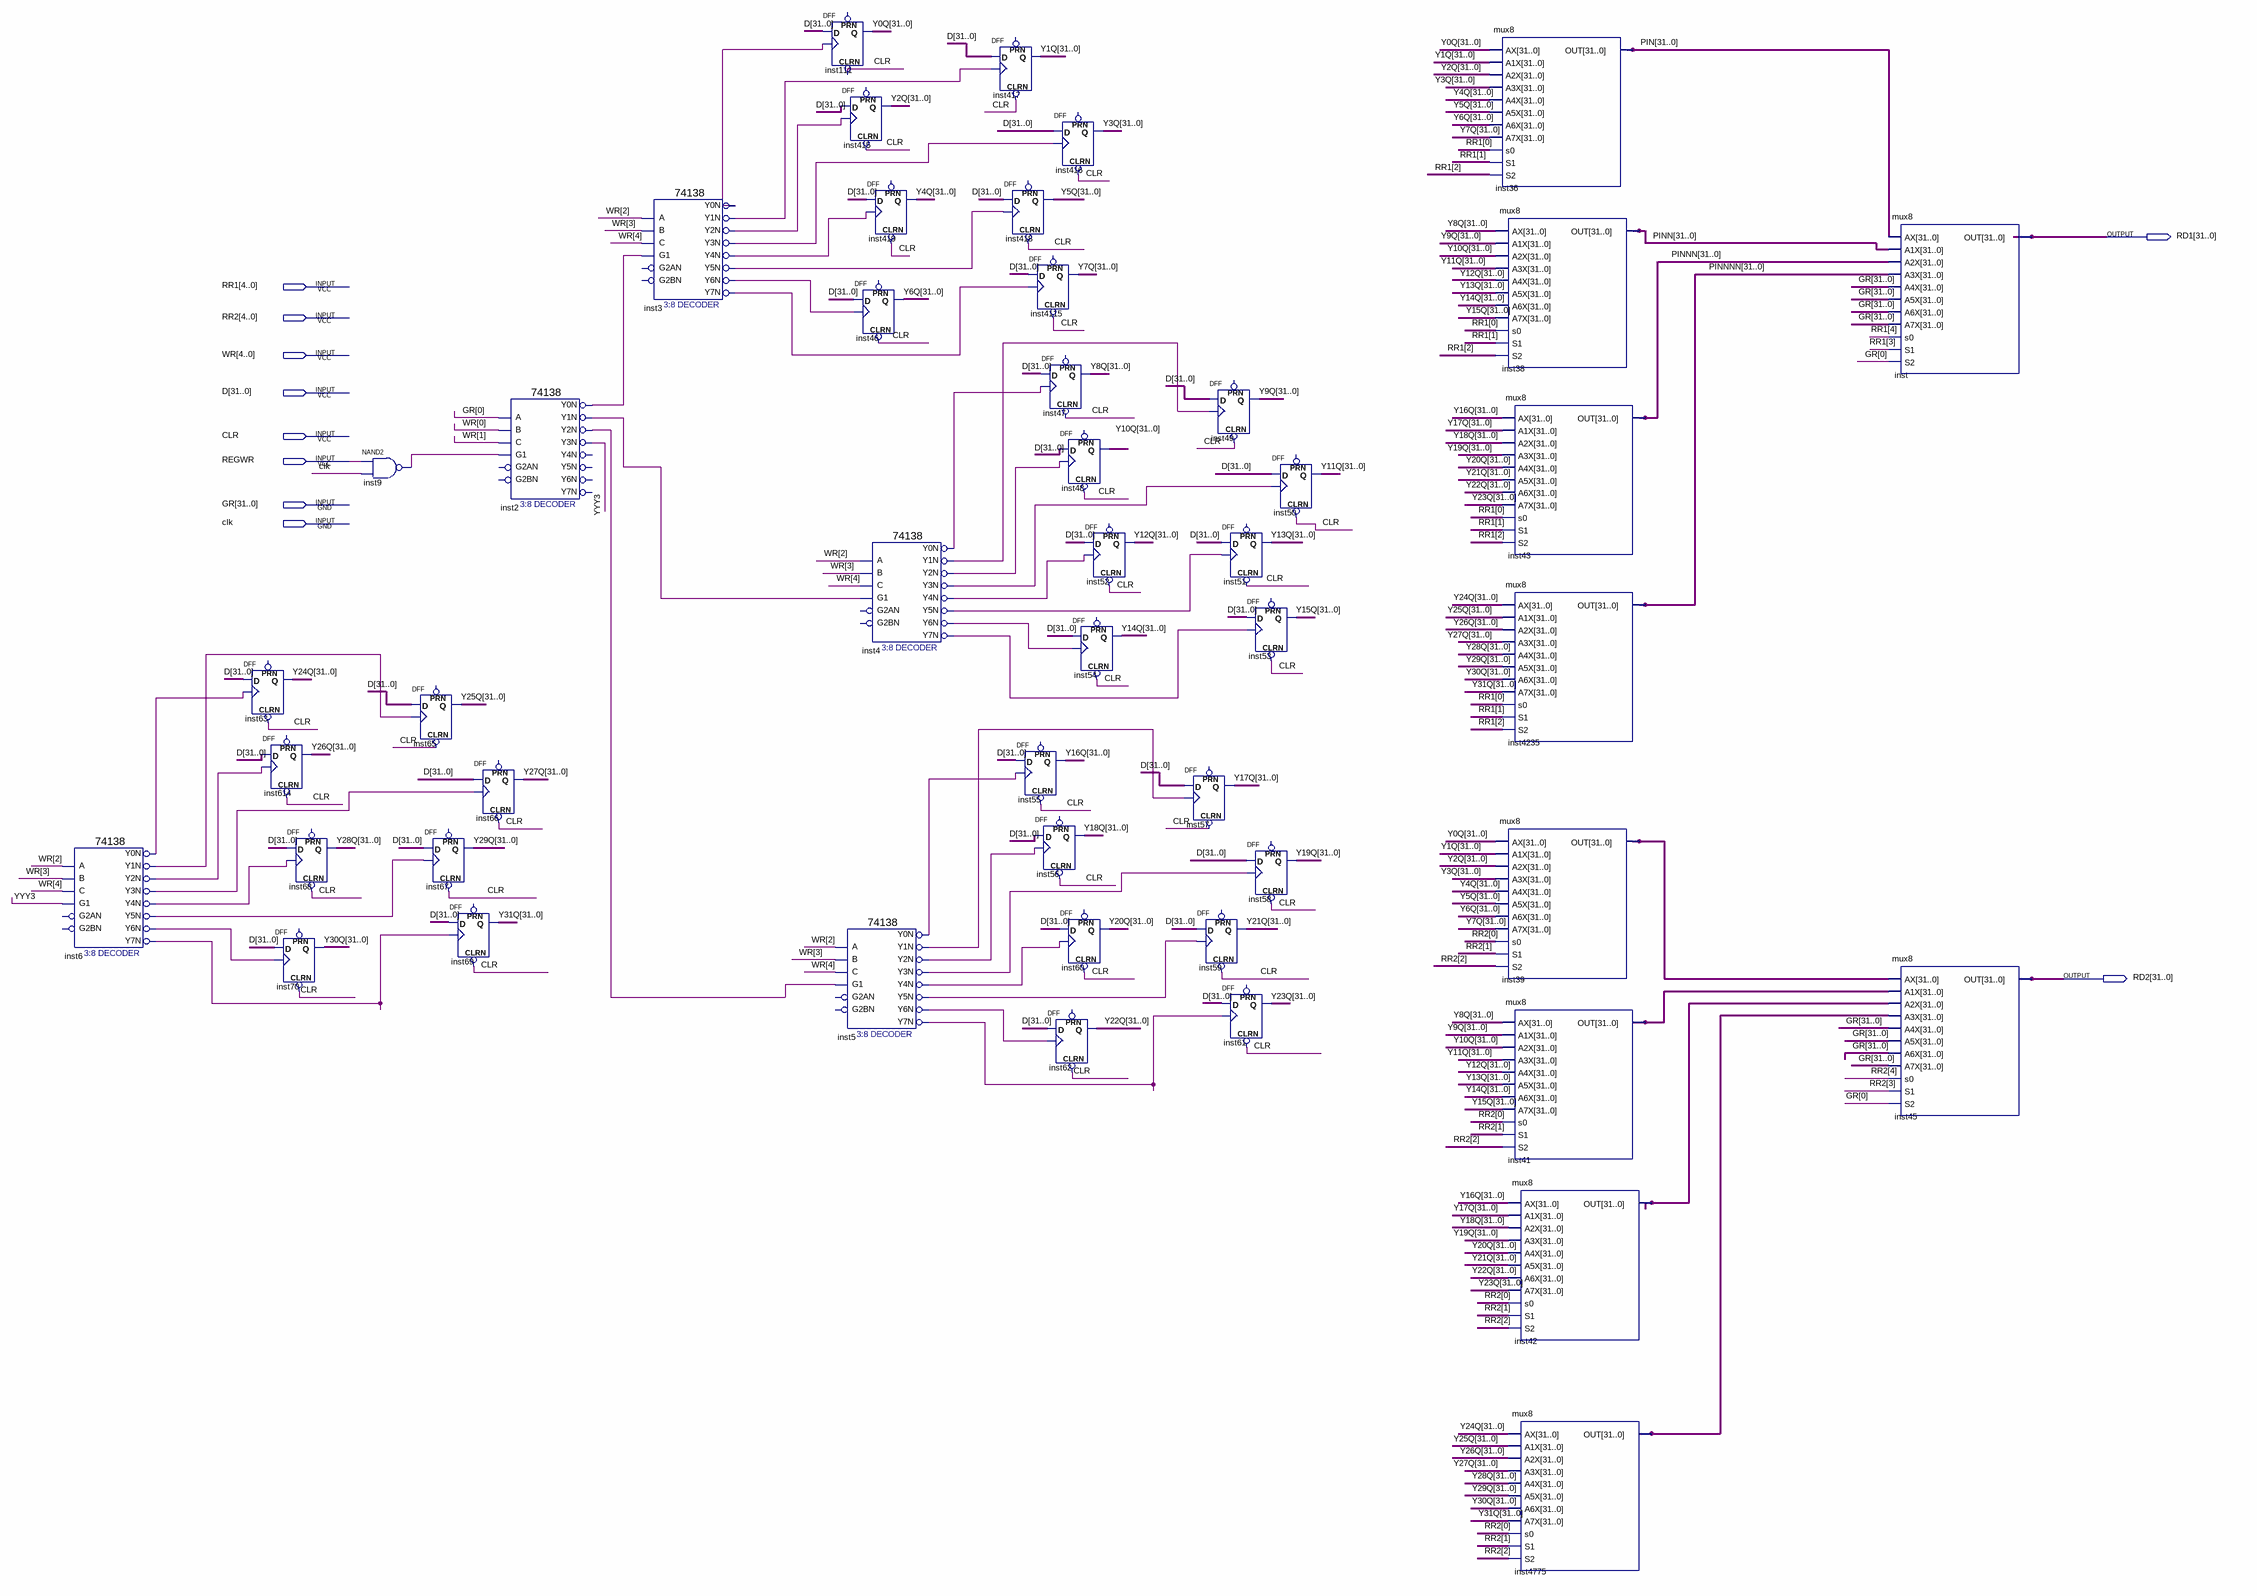
[diagram p0: schematic sheet]
// Quartus schematic caprj4.bdf as structural Verilog: 48 symbols, 10 pins
module caprj4 (
  input  [4:0] RR1,
  input  [4:0] RR2,
  input  [4:0] WR,
  input  [31:0] D,
  input  CLR,
  input  REGWR,
  input  [31:0] GR,
  input  clk,
  output [31:0] RD1,
  output [31:0] RD2
);

  wire inst2_y0n, inst2_y1n, inst2_y2n, inst3_y0n, inst3_y1n, inst3_y2n, inst3_y3n, inst3_y4n, inst3_y5n,
       inst3_y6n, inst3_y7n, inst4_y0n, inst4_y1n, inst4_y2n, inst4_y3n, inst4_y4n, inst4_y5n, inst4_y6n,
       inst4_y7n, inst5_y0n, inst5_y1n, inst5_y2n, inst5_y3n, inst5_y4n, inst5_y5n, inst5_y6n, inst5_y7n,
       inst6_y0n, inst6_y1n, inst6_y2n, inst6_y3n, inst6_y4n, inst6_y5n, inst6_y6n, inst6_y7n, inst9_out,
       YYY3;
  wire [31:0] inst39_out, inst41_out, inst42_out, inst4775_out, PIN, PINN, PINNN, PINNNN, Y0Q, Y1Q, Y2Q, Y3Q,
       Y4Q, Y5Q, Y6Q, Y7Q, Y8Q, Y9Q, Y10Q, Y11Q, Y12Q, Y13Q, Y14Q, Y15Q, Y16Q, Y17Q, Y18Q, Y19Q, Y20Q, Y21Q,
       Y22Q, Y23Q, Y24Q, Y25Q, Y26Q, Y27Q, Y28Q, Y29Q, Y30Q, Y31Q;

  \74138  inst6 (
    .A(WR[2]), .B(WR[3]), .G1(YYY3), .C(WR[4]), .Y0N(inst6_y0n), .Y1N(inst6_y1n), .Y2N(inst6_y2n),
    .Y3N(inst6_y3n), .Y4N(inst6_y4n), .Y5N(inst6_y5n), .Y6N(inst6_y6n), .Y7N(inst6_y7n));  // open: G2AN, G2BN
  DFF inst63[31:0] (.CLRN(CLR), .CLK(inst6_y0n), .D(D), .Q(Y24Q));  // open: PRN
  DFF inst614[31:0] (.CLRN(CLR), .CLK(inst6_y2n), .D(D), .Q(Y26Q));  // open: PRN
  DFF inst70[31:0] (.CLRN(CLR), .CLK(inst6_y6n), .D(D), .Q(Y30Q));  // open: PRN
  DFF inst68[31:0] (.CLRN(CLR), .CLK(inst6_y4n), .D(D), .Q(Y28Q));  // open: PRN
  nand inst9 (inst9_out, REGWR, clk);
  DFF inst65[31:0] (.CLRN(CLR), .CLK(inst6_y1n), .D(D), .Q(Y25Q));  // open: PRN
  DFF inst67[31:0] (.CLRN(CLR), .CLK(inst6_y5n), .D(D), .Q(Y29Q));  // open: PRN
  DFF inst66[31:0] (.CLRN(CLR), .CLK(inst6_y3n), .D(D), .Q(Y27Q));  // open: PRN
  DFF inst69[31:0] (.CLRN(CLR), .CLK(inst6_y7n), .D(D), .Q(Y31Q));  // open: PRN
  \74138  inst2 (
    .A(GR[0]), .B(WR[0]), .G1(inst9_out), .C(WR[1]), .Y0N(inst2_y0n), .Y1N(inst2_y1n), .Y2N(inst2_y2n),
    .Y3N(YYY3));  // open: G2AN, G2BN, Y4N, Y5N, Y6N, Y7N
  \74138  inst3 (
    .A(WR[2]), .B(WR[3]), .G1(inst2_y0n), .C(WR[4]), .Y0N(inst3_y0n), .Y1N(inst3_y1n), .Y2N(inst3_y2n),
    .Y3N(inst3_y3n), .Y4N(inst3_y4n), .Y5N(inst3_y5n), .Y6N(inst3_y6n), .Y7N(inst3_y7n));  // open: G2AN, G2BN
  DFF inst111[31:0] (.CLRN(CLR), .CLK(inst3_y0n), .D(D), .Q(Y0Q));  // open: PRN
  DFF inst415[31:0] (.CLRN(CLR), .CLK(inst3_y2n), .D(D), .Q(Y2Q));  // open: PRN
  DFF inst419[31:0] (.CLRN(CLR), .CLK(inst3_y4n), .D(D), .Q(Y4Q));  // open: PRN
  DFF inst46[31:0] (.CLRN(CLR), .CLK(inst3_y6n), .D(D), .Q(Y6Q));  // open: PRN
  \74138  inst4 (
    .A(WR[2]), .B(WR[3]), .G1(inst2_y1n), .C(WR[4]), .Y0N(inst4_y0n), .Y1N(inst4_y1n), .Y2N(inst4_y2n),
    .Y3N(inst4_y3n), .Y4N(inst4_y4n), .Y5N(inst4_y5n), .Y6N(inst4_y6n), .Y7N(inst4_y7n));  // open: G2AN, G2BN
  \74138  inst5 (
    .A(WR[2]), .B(WR[3]), .G1(inst2_y2n), .C(WR[4]), .Y0N(inst5_y0n), .Y1N(inst5_y1n), .Y2N(inst5_y2n),
    .Y3N(inst5_y3n), .Y4N(inst5_y4n), .Y5N(inst5_y5n), .Y6N(inst5_y6n), .Y7N(inst5_y7n));  // open: G2AN, G2BN
  DFF inst417[31:0] (.CLRN(CLR), .CLK(inst3_y1n), .D(D), .Q(Y1Q));  // open: PRN
  DFF inst418[31:0] (.CLRN(CLR), .CLK(inst3_y5n), .D(D), .Q(Y5Q));  // open: PRN
  DFF inst55[31:0] (.CLRN(CLR), .CLK(inst5_y0n), .D(D), .Q(Y16Q));  // open: PRN
  DFF inst416[31:0] (.CLRN(CLR), .CLK(inst3_y3n), .D(D), .Q(Y3Q));  // open: PRN
  DFF inst4115[31:0] (.CLRN(CLR), .CLK(inst3_y7n), .D(D), .Q(Y7Q));  // open: PRN
  DFF inst47[31:0] (.CLRN(CLR), .CLK(inst4_y0n), .D(D), .Q(Y8Q));  // open: PRN
  DFF inst48[31:0] (.CLRN(CLR), .CLK(inst4_y2n), .D(D), .Q(Y10Q));  // open: PRN
  DFF inst54[31:0] (.CLRN(CLR), .CLK(inst4_y6n), .D(D), .Q(Y14Q));  // open: PRN
  DFF inst56[31:0] (.CLRN(CLR), .CLK(inst5_y2n), .D(D), .Q(Y18Q));  // open: PRN
  DFF inst60[31:0] (.CLRN(CLR), .CLK(inst5_y4n), .D(D), .Q(Y20Q));  // open: PRN
  DFF inst62[31:0] (.CLRN(CLR), .CLK(inst5_y6n), .D(D), .Q(Y22Q));  // open: PRN
  DFF inst52[31:0] (.CLRN(CLR), .CLK(inst4_y4n), .D(D), .Q(Y12Q));  // open: PRN
  DFF inst49[31:0] (.CLRN(CLR), .CLK(inst4_y1n), .D(D), .Q(Y9Q));  // open: PRN
  DFF inst51[31:0] (.CLRN(CLR), .CLK(inst4_y5n), .D(D), .Q(Y13Q));  // open: PRN
  DFF inst57[31:0] (.CLRN(CLR), .CLK(inst5_y1n), .D(D), .Q(Y17Q));  // open: PRN
  DFF inst59[31:0] (.CLRN(CLR), .CLK(inst5_y5n), .D(D), .Q(Y21Q));  // open: PRN
  DFF inst61[31:0] (.CLRN(CLR), .CLK(inst5_y7n), .D(D), .Q(Y23Q));  // open: PRN
  DFF inst50[31:0] (.CLRN(CLR), .CLK(inst4_y3n), .D(D), .Q(Y11Q));  // open: PRN
  DFF inst53[31:0] (.CLRN(CLR), .CLK(inst4_y7n), .D(D), .Q(Y15Q));  // open: PRN
  DFF inst58[31:0] (.CLRN(CLR), .CLK(inst5_y3n), .D(D), .Q(Y19Q));  // open: PRN
  mux8 inst36 (
    .AX(Y0Q), .A1X(Y1Q), .A2X(Y2Q), .A3X(Y3Q), .A4X(Y4Q), .A5X(Y5Q), .A6X(Y6Q), .A7X(Y7Q), .s0(RR1[0]),
    .S1(RR1[1]), .S2(RR1[2]), .OUT(PIN));
  mux8 inst38 (
    .AX(Y8Q), .A1X(Y9Q), .A2X(Y10Q), .A3X(Y11Q), .A4X(Y12Q), .A5X(Y13Q), .A6X(Y14Q), .A7X(Y15Q), .s0(RR1[0]),
    .S1(RR1[1]), .S2(RR1[2]), .OUT(PINN));
  mux8 inst43 (
    .AX(Y16Q), .A1X(Y17Q), .A2X(Y18Q), .A3X(Y19Q), .A4X(Y20Q), .A5X(Y21Q), .A6X(Y22Q), .A7X(Y23Q),
    .s0(RR1[0]), .S1(RR1[1]), .S2(RR1[2]), .OUT(PINNN));
  mux8 inst4235 (
    .AX(Y24Q), .A1X(Y25Q), .A2X(Y26Q), .A3X(Y27Q), .A4X(Y28Q), .A5X(Y29Q), .A6X(Y30Q), .A7X(Y31Q),
    .s0(RR1[0]), .S1(RR1[1]), .S2(RR1[2]), .OUT(PINNNN));
  mux8 inst39 (
    .AX(Y0Q), .A1X(Y1Q), .A2X(Y2Q), .A3X(Y3Q), .A4X(Y4Q), .A5X(Y5Q), .A6X(Y6Q), .A7X(Y7Q), .s0(RR2[0]),
    .S1(RR2[1]), .S2(RR2[2]), .OUT(inst39_out));
  mux8 inst41 (
    .AX(Y8Q), .A1X(Y9Q), .A2X(Y10Q), .A3X(Y11Q), .A4X(Y12Q), .A5X(Y13Q), .A6X(Y14Q), .A7X(Y15Q), .s0(RR2[0]),
    .S1(RR2[1]), .S2(RR2[2]), .OUT(inst41_out));
  mux8 inst42 (
    .AX(Y16Q), .A1X(Y17Q), .A2X(Y18Q), .A3X(Y19Q), .A4X(Y20Q), .A5X(Y21Q), .A6X(Y22Q), .A7X(Y23Q),
    .s0(RR2[0]), .S1(RR2[1]), .S2(RR2[2]), .OUT(inst42_out));
  mux8 inst4775 (
    .AX(Y24Q), .A1X(Y25Q), .A2X(Y26Q), .A3X(Y27Q), .A4X(Y28Q), .A5X(Y29Q), .A6X(Y30Q), .A7X(Y31Q),
    .s0(RR2[0]), .S1(RR2[1]), .S2(RR2[2]), .OUT(inst4775_out));
  mux8 inst (
    .AX(PIN), .A1X(PINN), .A2X(PINNN), .A3X(PINNNN), .A4X(GR), .A5X(GR), .A6X(GR), .A7X(GR), .s0(RR1[4]),
    .S1(RR1[3]), .S2(GR[0]), .OUT(RD1));
  mux8 inst45 (
    .AX(inst39_out), .A1X(inst41_out), .A2X(inst42_out), .A3X(inst4775_out), .A4X(GR), .A5X(GR), .A6X(GR),
    .A7X(GR), .s0(RR2[4]), .S1(RR2[3]), .S2(GR[0]), .OUT(RD2));
endmodule
